# EAGLE design USB-Knob (EAGLE 6.4)
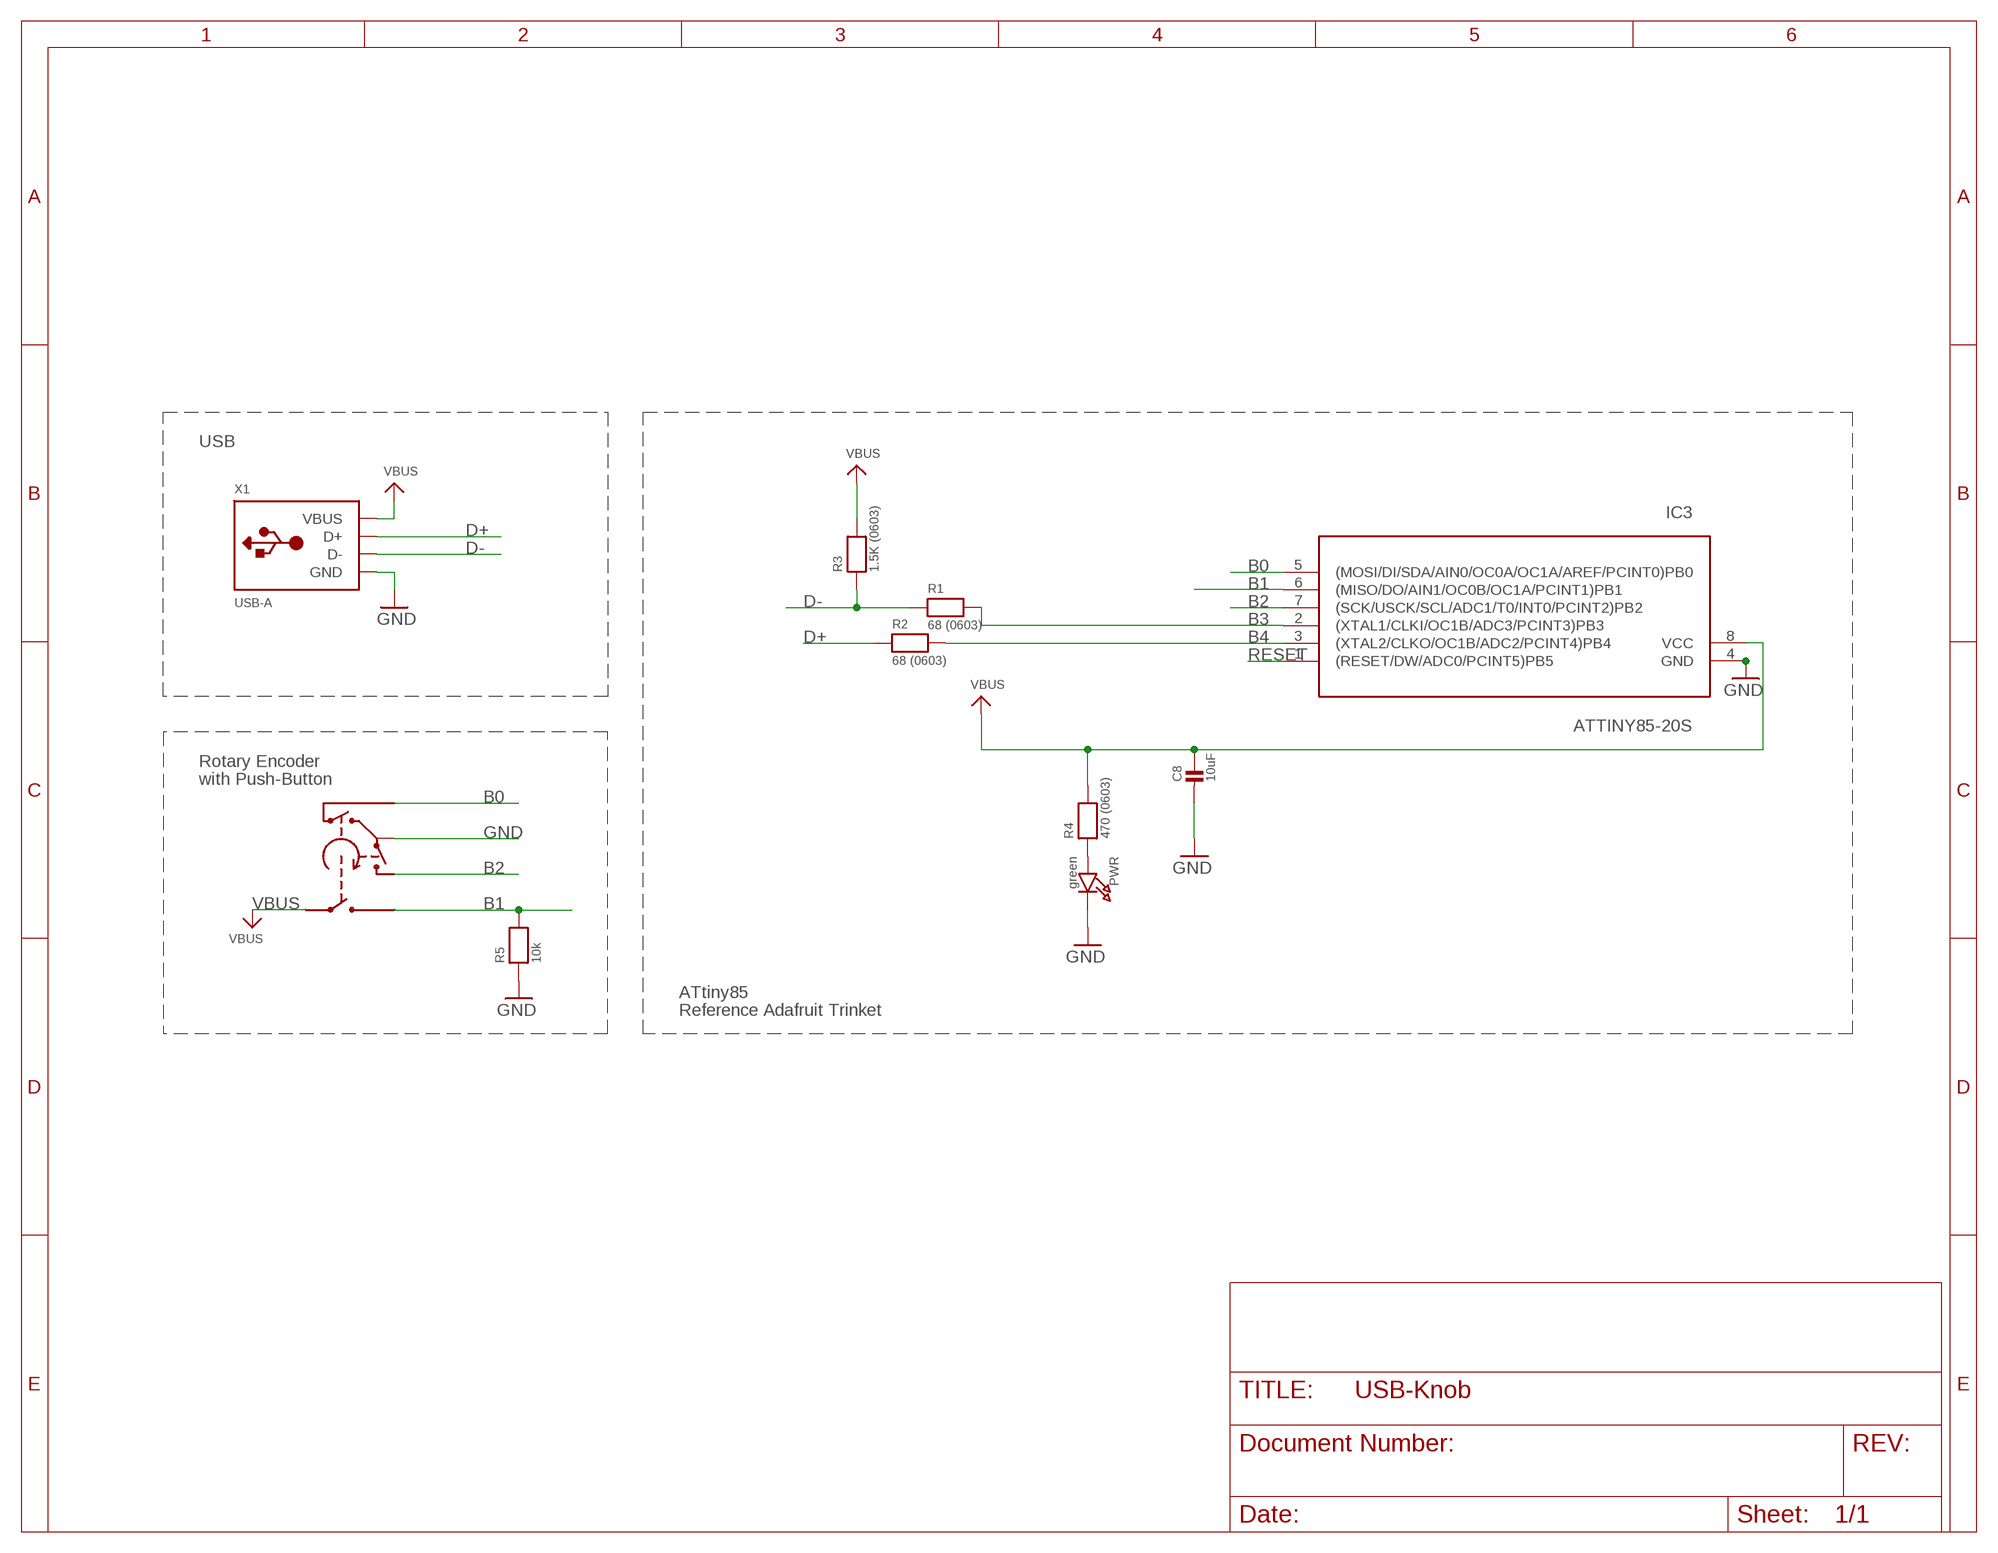
[diagram p0: schematic, sheet 1]

## Parts
C8  10uF  CAP_CERAMIC0805-NOOUTLINE  [0805-NO]
IC3  ATTINY85-20S  ATTINY85V-10S  [SOIC8]
PWR  green  LED0805_NOOUTLINE  [CHIPLED_0805_NOOUTLINE]
R1  68 (0603)  RESISTOR_0603_NOOUT  [0603-NO]
R2  68 (0603)  RESISTOR_0603_NOOUT  [0603-NO]
R3  1.5K (0603)  RESISTOR_0603_NOOUT  [0603-NO]
R4  470 (0603)  RESISTOR_0603_NOOUT  [0603-NO]
R5  10k  RESISTOR_0603_NOOUT  [0603-NO]
U$2  ALPHA-ROT-ENCODER  [TW-700198]
X1  USB-A  [MOLEX_480371000]

## Nets
B0: IC3.5((MOSI/DI/SDA/AIN0/OC0A/OC1A/AREF/PCINT0)PB0) U$2.P3(A)
B1: IC3.6((MISO/DO/AIN1/OC0B/OC1A/PCINT1)PB1) R5.2 U$2.P5(S2)
B2: IC3.7((SCK/USCK/SCL/ADC1/T0/INT0/PCINT2)PB2) U$2.P1(B)
B3: IC3.2((XTAL1/CLKI/OC1B/ADC3/PCINT3)PB3) R1.2
B4: IC3.3((XTAL2/CLKO/OC1B/ADC2/PCINT4)PB4) R2.2
D+: R2.1 X1.3(D+)
D-: R1.1 R3.1 X1.2(D-)
GND: C8.2 IC3.4(GND) PWR.C R5.1 U$2.P2(COM) X1.4(GND)
N$6: PWR.A R4.1
RESET: IC3.1((RESET/DW/ADC0/PCINT5)PB5)
VBUS: C8.1 IC3.8(VCC) R3.2 R4.2 U$2.P4(S1) X1.1(VBUS)

## Notes on the sheet
- USB
- Rotary Encoder
- with Push-Button
- ATtiny85
- Reference Adafruit Trinket

## Library data of the parts
C8 = microbuilder:CAP_CERAMIC: Ceramic Capacitors For new designs, use the packages preceded by an '_' character since they are more reliable: The following footprints should be used on most boards: _0402 - Standard footprint for regular board layouts _0603 - Standard footprint for regular board layouts _0805 - Standard footprint for regular board layouts For extremely tight-pitch boards where space is at a premium, the following 'micro-pitch' footprints can be used (smaller pads, no silkscreen outline, etc.): _0402MP - Micro-pitch footprint for very dense/compact boards _0603MP - Micro-pitch footprint for very dense/compact boards _0805MP - Micro-pitch footprint for very dense/compact boards Commonly Stocked Parts 0402 - 0402 Surface Mount Capacitors 16pF 50V 5% [Digikey: 445-4899-2-ND] 18pF 50V 5% [Digikey: 490-1281-2-ND] 22pF 50V 5% [Digikey: 490-1283-2-ND] 68pF 50V 5% [Digikey: 490-1289-2-ND] 0.1uF 10V 10% [Digikey: 490-1318-2-ND] 1.0uF 6.3V 10% [Digikey: 490-1320-2-ND] 0603 - 0603 Surface Mount Capacitors 16 pF 50V 5% [Digikey: 445-5051-2-ND] 22 pF 50V [Digikey: PCC220ACVTR-ND] 33 pF 50V 5% [Digikey: 490-1415-1-ND] 56pF 50V 5% [Digikey: 490-1421-1-ND] 220pF 50V 5% [Digikey: 445-1285-1-ND] 680 pF 50V 2200 pF 50V 5% C0G [Digikey: 445-1297-1-ND] 5600 pF 100V 5% X7R [Digikey: 478-3711-1-ND] 0.1 µF 25V 10% [Digikey: PCC2277TR-ND] 0.22 µF 16V 10% X7R [Digikey: 445-1318-1-ND] 1.0 µF 25V 10% [Digikey: 445-5146-2-ND] 0603 - RF Specific 3pF 250V +/-0.1pF RF [Digikey: 712-1347-1-ND] 18 pF 250V 5% [Digikey: 478-3505-1-ND or 712-1322-1-ND] 56 pF 250V 5% C0G RF [Digikey: 490-4867-1-ND] 68 pF 250V RF [Digikey: 490-4868-1-ND] 0805 - 0805 Surface Mount Capacitors 220 pF 250V 2% RF Ceramic Capacitor [Digikey: 712-1398-1-ND] 1000 pF 50V 2% NP0 Ceramic Capacitor [Digikey: 478-3760-1-ND] 0.1 µF 25V 10% Ceramic Capacitor [Digikey: PCC1828TR-ND] 1.0 µF 16V 10% Ceramic Capacitor[Digikey: 490-1691-2-ND] 10.0 µF 10V 10% Ceramic Capacitor[Digikey: 709-1228-1-ND] 10.0 uF 16V 10% Ceramic Capacitor [Digikey: 478-5165-2-ND] 47 uF 6.3V 20% Ceramic Capacitor [Digikey: 587-1779-1-ND or 399-5506-1-ND] 1206 - 1206 Surface Mount Capacitors 47uF 10V 20% Ceramic Capacitor [Digikey: 490-5528-1-ND or 399-5508-1-ND or 445-6010-1-ND] 100uF 6.3V -20%, +80% Y5V Ceramic Capacitor (Digikey: 490-4512-1-ND, Mouser: 81-GRM31CF50J107ZE1L)
IC3 = avr:ATTINY85: MICROCONTROLLER 8 Kbytes FLASH 512 bytes EEPROM 512 bytes RAM 4-channel 10 bit ADC USI
PWR = microbuilder:LED: LED 0603 - 0603 Surface Mount Package 2mA: Green LED - Low Power (3.9mcd, 2ma, 1.7Vf) - Digikey: 475-2709-2-ND Orange LED - Low Power (9.8mcd, 2ma, 1.8Vf) - Digikey: 475-1194-2-ND Red LED - Low Power (5mcd, 2ma, 1.8Vf) - Digikey: 475-1195-2-ND Yellow LED - Low Power (7mcd, 2ma, 1.8Vf) - Digikey: 475-1196-2-ND 5mA: Blue LED - Low Power (17mcd, 5ma, 2.9Vf) - Digikey: LNJ937W8CRACT-ND 0805 - 0805 Surface Mount Package 2mA: Red LED (8.8mcd, 2mA, 1.8Vf, Clear) - Low Power [Digikey: 475-2510-1-ND] Green LED (5mcd, 2mA, 1.8Vf, Clear) - Low Power [Digikey: 475-2730-1-ND] Yellow LED (11.3mcd, 2mA, 1.8Vf, Clear) - Low Power [Digikey: 475-2555-1-ND] 20mA: Red LED (104mcd, 20mA, Diffused) - LS R976 [Digikey: 475-1278-6-ND] Red LED (12mcd, 20mA, 2.0Vf, Clear) - APT2012EC [Digikey: 754-1128-1-ND] Green LED (15mcd, 20mA, 2.2Vf, Clear) - APT2012GC [Digikey: 754-1131-1-ND] Orange LED (160mcd, 20mA, 2.1Vf, Clear) - APT2012SECK [Digikey: 754-1130-1-ND] 1206 - 1206 Surface Mount Package Green LED (26mcd, 20mA, Diffused) - LG N971 [Digikey: 475-1407-6-ND] Red LED (15mcd, 20mA, Diffused) - LH N974 [Digikey: 475-1416-6-ND] Cree - Cree High-Power Surface Mount LEDs XPEBWT-L1-0000-00D50 - White 111lm 350mA 2.9Vf 6200K 110° XTEAWT-00-0000-00000LEE3 - White 114lm 350mA 2.85Vf 5000K 115° Everlight - Everlight 45-21 Series Surface Mount LEDs 45-21/QK2C-B2832AC2CB2/2T - Warm White 2000mcd 20mA 3.25Vf 3050K 120° 45-21/LK2C-B38452C4CB2/2T - Nuetral White 2000mcd 20mA 3.25Vf 4150K 120° 45-21/LK2C-B50634C6CB2/2T - Cold White 2200mcd 20mA 3.25Vf 5650K 120° PLCC2 Reverse Mount LS T77K-J1L2-1-0-2-R18-Z - Red 11.25mcd 2mA 1.8Vf 630nm 120° LO T77K-L1M2-24-Z - Orange 19.6mcd 2mA 1.8Vf 606nm 120° LY T77K-K2M1-26-Z - Yellow 15.7mcd 2mA 1.8Vf 587nm 120°
R1-R5 = microbuilder:RESISTOR: Resistors For new designs, use the packages preceded by an '_' character since they are more reliable: The following footprints should be used on most boards: _0402 - Standard footprint for regular board layouts _0603 - Standard footprint for regular board layouts _0805 - Standard footprint for regular board layouts For extremely tight-pitch boards where space is at a premium, the following 'micro-pitch' footprints can be used (smaller pads, no silkscreen outline, etc.): _0402MP - Micro-pitch footprint for very dense/compact boards _0603MP - Micro-pitch footprint for very dense/compact boards _0805MP - Micro-pitch footprint for very dense/compact boards
U$2 = SteMarie:ALPHA-ROT-ENCODER: Rotary encoder w pushbutton switch.
X1 = adafruit:USB-A: USB type A 'plug' Used for things that can directly connect to a USB port, say USB key

## Net classes
1 power: width 0.305 mm

## Board
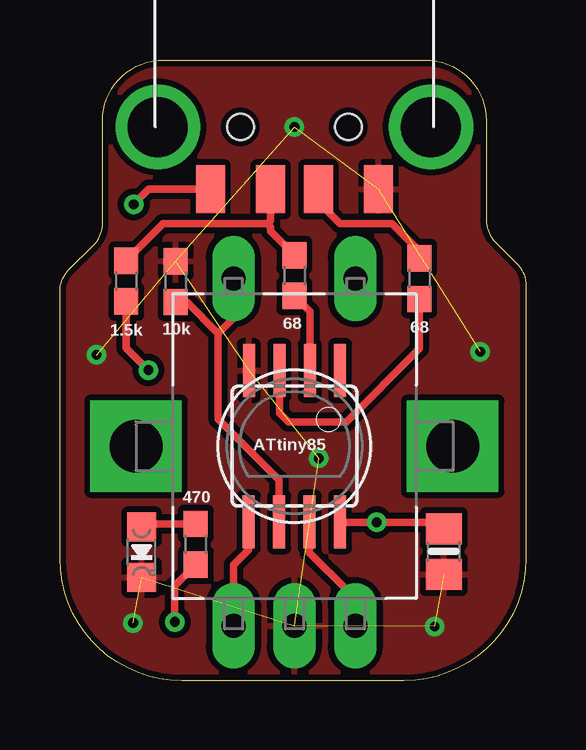
[diagram p1: board, top side]
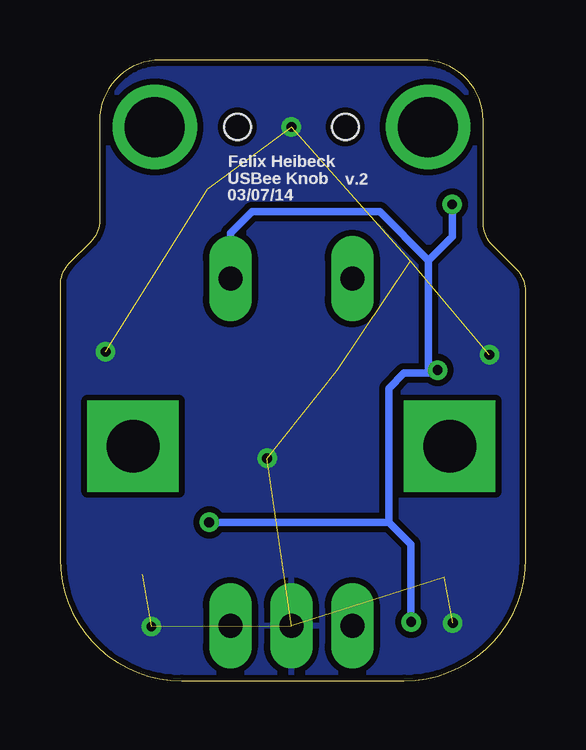
[diagram p2: board, bottom side, seen from below]

Size 19.43 x 25.88 mm. Coordinates in mm from the lower left corner, seen from the top.
Outline: 4.32,25.88 15.24,25.88 arc-90 17.78,23.34 17.78,19.2 arc45 18.15,18.3 19.06,17.39 arc-45 19.43,16.49 19.43,5.08 arc-90 14.35,0 5.08,0 arc-90 0,5.08 0,16.24 arc-45 0.37,17.14 1.41,18.17 arc45 1.78,19.07 1.78,23.34 arc-90 4.32,25.88
Copper layers (1*16): Top 0.035mm / dielectric 1.5mm / Bottom 0.035mm
Design rules "adafruit *": minimum track width 8mil, minimum drill 15.5mil, track to track 10mil, track to pad 10mil, pad to pad 10mil, via to via 10mil, smd to smd 8mil, copper to edge 10mil, drill to drill 8mil, minimum pad ring 10mil, minimum via ring 8mil, stop-mask expansion 4mil, vias tented up to drill 20mil, thermal gap 10mil

### Footprints (pad centres in the part's own frame; a part is rotated, then mirrored left to right if it is on the bottom)
0805-NO = smd 1.3 x 1.5: 1 -0.95,0; 2 0.95,0
SOIC8 = smd 0.5 x 2.2: 1 -1.905,-3.154; 2 -0.645,-3.154; 3 0.625,-3.154; 4 1.895,-3.154; 5 1.905,3.154; 6 0.635,3.154; 7 -0.635,3.154; 8 -1.905,3.154
CHIPLED_0805_NOOUTLINE = smd 1.2 x 1.2: A 0,-1.05; C 0,1.05
0603-NO = smd 1.1 x 1: 1 -0.85,0; 2 0.85,0
TW-700198 = drill 2.2 pad 3.81 square: NC1 0,6.604; NC2 0,-6.604 | drill 1 pad 1.778 long: P1 7.493,2.54; P2 7.493,0; P3 7.493,-2.54; P4 -6.985,2.54; P5 -6.985,-2.54
MOLEX_480371000 = smd 1.2 x 2: 1 3.5,2.6; 2 1,2.6; 3 -1,2.6; 4 -3.5,2.6 | drill 2.5: M1 -5.7,0; M2 5.7,0 | hole 1.1: -2.25,0; 2.25,0

### Placement (x,y rotation side)
C8  16,5.38 270 top
IC3  9.78,9.78 180 top
PWR  3.4,5.36 180 top
R1  9.78,16.89 270 top
R2  14.99,16.76 270 top
R3  2.77,16.66 270 top
R4  5.66,5.69 270 top
R5  4.83,16.64 270 top
U$2  9.78,9.78 270 top
X1  9.78,23.09 180 top

### Tracks (layer width: path | path; a pad name or v marks a point on that pad's centre or on a via)
B0
  Top 0.305: IC3.5 7.87,5.46 7.24,4.83 U$2.P3
B1
  Top 0.305: U$2.P5 7.24,15.11 6.6,14.48 | 6.6,14.48 6.6,10.92 9.14,8.38 IC3.6 | R5.2 5.29,15.79 6.6,14.48
B2
  Top 0.305: IC3.7 10.41,5.33 12.06,3.68 12.06,2.54 U$2.P1
B3
  Top 0.305: IC3.2 10.42,15.4 R1.2
B4
  Top 0.305: IC3.3 9.15,11.17 9.52,10.8 11.94,10.8 14.99,13.84 R2.2
D+
  Top 0.305: R2.1 14.99,17.91 13.84,19.05 11.68,19.05 10.79,19.94 10.79,20.63 X1.3
D-
  Top 0.305: R1.1 8.78,18.74 8.78,18.92 8.65,19.05 | 8.65,19.05 4.31,19.05 R3.1 | X1.2 8.78,19.18 8.65,19.05
GND  (via drill 0.41)  (11 unrouted)
  other vias: 17.53,13.72 1.52,13.59 3.05,2.41 15.62,2.26 10.79,9.27 9.78,23.09
  pour Bottom: -4.45,29.08 -4.19,-1.78 21.84,-1.52 21.46,29.08
  pour Top: -3.94,29.59 -3.94,-4.83 25.15,-4.95 25.15,29.46
N$6
  Top 0.305: R4.1 3.53,6.54 PWR.A
VBUS  (via drill 0.41)
  Top 0.305: 4.83,2.41 v4.79,2.45 4.79,3.96 R4.2 | IC3.8 11.7,6.6 v13.21,6.6 15.73,6.6 C8.1 | 6.24,20.6 X1.1 3.7,20.49 v3.07,19.86 | R3.2 2.77,13.87 v3.68,12.95
  Bottom 0.305: v4.79,2.45 4.79,5.68 5.71,6.6 | 5.71,6.6 v13.21,6.6 | 5.71,6.6 5.71,12.19 5.08,12.83 4.06,12.83 | 4.06,12.83 3.81,12.83 v3.68,12.95 | 4.06,12.83 4.06,17.53 | 4.06,17.53 6.1,19.56 11.43,19.56 12.32,18.67 U$2.P4 | v3.07,19.86 3.07,18.52 4.06,17.53

### Text on the board
tPlace: 68 | 1.5k | 10k | 68 | ATtiny85 | 470
bPlace: v.2 | Felix Heibeck | USBee Knob | 03/07/14